# Altium schematic sheet lv_io_solenoid_drv.SchDoc
size A4; Organization: Badgerloop; Address1: 133 Engineering Research; Address2: Building; Address3: Madison, WI 53715
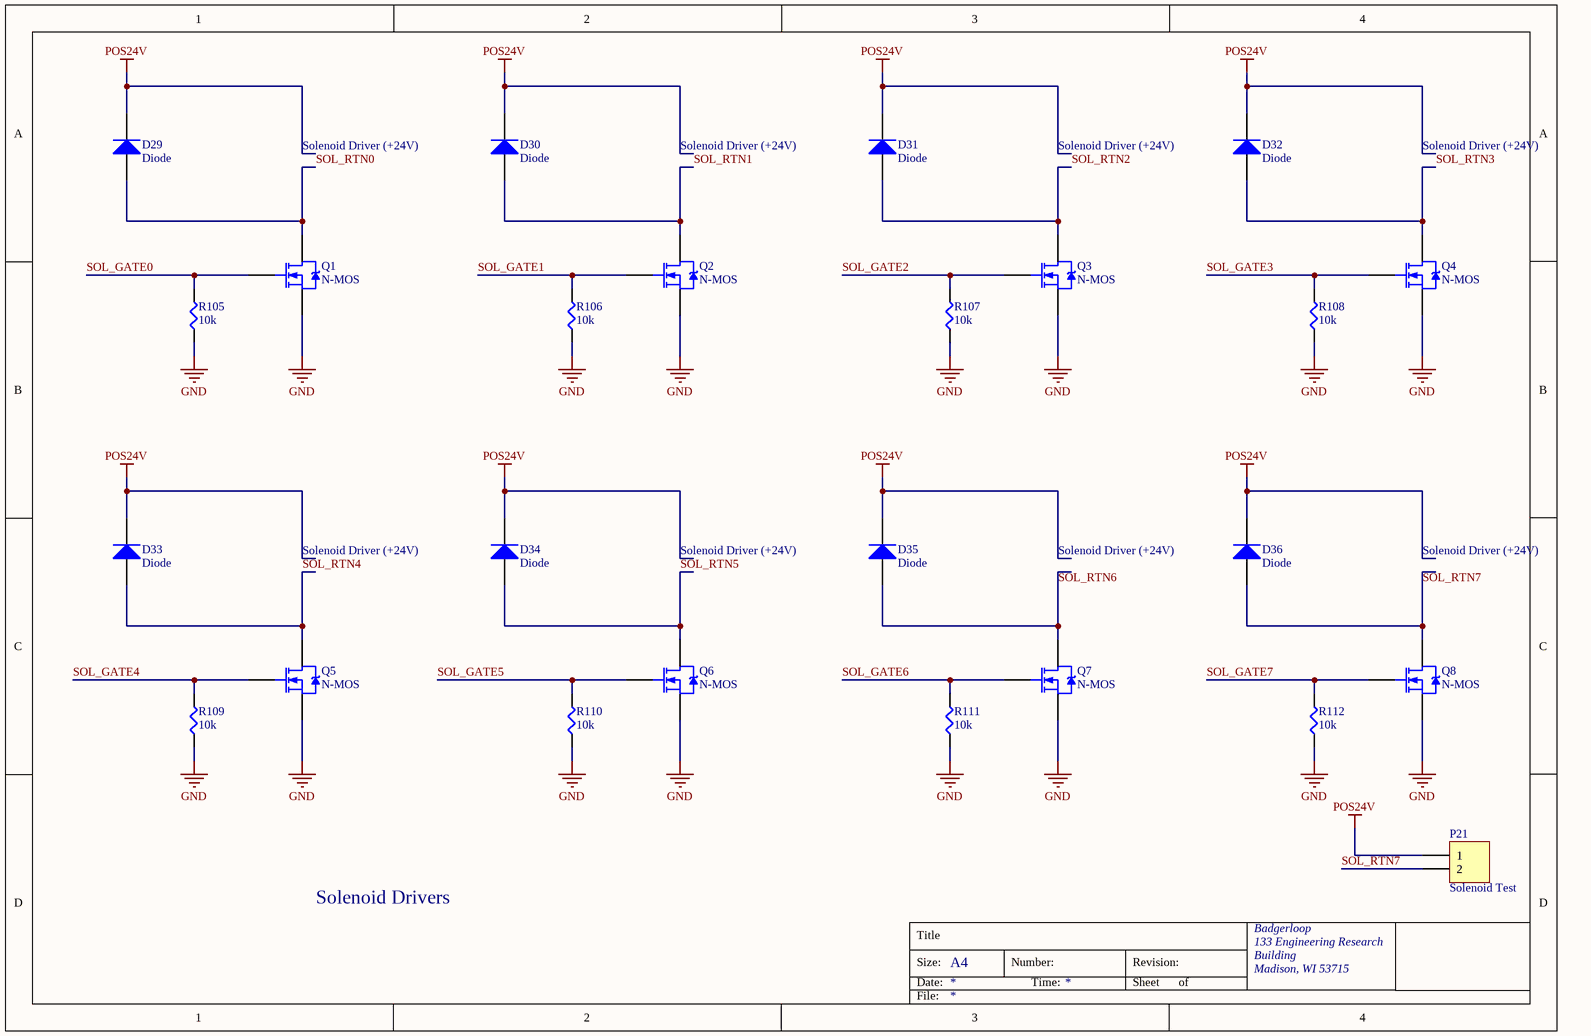
[diagram p0: lv_io_solenoid_drv.SchDoc]

## Parts
D29  Diode  [SODFL360X110-2N]
D30  Diode  [SODFL360X110-2N]
D31  Diode  [SODFL360X110-2N]
D32  Diode  [SODFL360X110-2N]
D33  Diode  [SODFL360X110-2N]
D34  Diode  [SODFL360X110-2N]
D35  Diode  [SODFL360X110-2N]
D36  Diode  [SODFL360X110-2N]
P21  Solenoid Test  [Pin Header 1x2 TH Pitch 2.54mm]
Q1  N-MOS  [DPAK228P991X238-3N]
Q2  N-MOS  [DPAK228P991X238-3N]
Q3  N-MOS  [DPAK228P991X238-3N]
Q4  N-MOS  [DPAK228P991X238-3N]
Q5  N-MOS  [DPAK228P991X238-3N]
Q6  N-MOS  [DPAK228P991X238-3N]
Q7  N-MOS  [DPAK228P991X238-3N]
Q8  N-MOS  [DPAK228P991X238-3N]
R105  10k  [SMD-0402-RES]
R106  10k  [SMD-0402-RES]
R107  10k  [SMD-0402-RES]
R108  10k  [SMD-0402-RES]
R109  10k  [SMD-0402-RES]
R110  10k  [SMD-0402-RES]
R111  10k  [SMD-0402-RES]
R112  10k  [SMD-0402-RES]

## Nets
GND: Q1.3(S) Q2.3(S) Q3.3(S) Q4.3(S) Q5.3(S) Q6.3(S) Q7.3(S) Q8.3(S) R105.1 R106.1 R107.1 R108.1 R109.1 R110.1 R111.1 R112.1
POS24V: D29.2(K) D30.2(K) D31.2(K) D32.2(K) D33.2(K) D34.2(K) D35.2(K) D36.2(K) P21.1
SOL_GATE0: Q1.1(G) R105.2
SOL_GATE1: Q2.1(G) R106.2
SOL_GATE2: Q3.1(G) R107.2
SOL_GATE3: Q4.1(G) R108.2
SOL_GATE4: Q5.1(G) R109.2
SOL_GATE5: Q6.1(G) R110.2
SOL_GATE6: Q7.1(G) R111.2
SOL_GATE7: Q8.1(G) R112.2
SOL_RTN0: D29.1(A) Q1.4(D)
SOL_RTN1: D30.1(A) Q2.4(D)
SOL_RTN2: D31.1(A) Q3.4(D)
SOL_RTN3: D32.1(A) Q4.4(D)
SOL_RTN4: D33.1(A) Q5.4(D)
SOL_RTN5: D34.1(A) Q6.4(D)
SOL_RTN6: D35.1(A) Q7.4(D)
SOL_RTN7: D36.1(A) P21.2 Q8.4(D)

## Notes on the sheet
- Solenoid Driver (+24V)
- Solenoid Drivers
- Title
- Size:
- Date:
- A4
- Number:
- Time:
- Revision:
- Sheet
- of
- File:

## Library data of the parts
D29-D36 = DIODE STD: DIODE GEN PURP 200V 2A SOD123FL; Manufacturer: ON SEMI; Manufacturer P/N: NHP220SFT3G; Digikey Link: https://www.digikey.com/product-detail/en/on-semiconductor/NHP220SFT3G/NHP220SFT3GOSCT-ND/5801747; Digikey P/N: NHP220SFT3GOSCT-ND
P21 = Header 2: Header, 2-Pin; LatestRevisionDate: 17-Jul-2002; LatestRevisionNote: Re-released for DXP Platform.; Publisher: Altium Limited
Q1-Q8 = N-MOS: N-Channel Power MOSFET, 12 A, 60 V; Manufacturer: ON SEMI; Manufacturer P/N: NTD3055L104T4G; Digikey Link: https://www.digikey.com/product-detail/en/on-semiconductor/NTD3055L104T4G/NTD3055L104T4GOSDKR-ND/1749196; Digikey P/N: NTD3055L104T4GOSDKR-ND
R105-R112 = ERJ-2RHD1002X: RES SMD 10K OHM 0.5% 1/16W 0402; Manufacturer: Panasonic Electronic Components; Factory Stock: 0; Unit Price (USD): 0.01767; @ qty: 1500; Minimum Quantity: 1; Power (Watts): 0.063W, 1/16W; Temperature Coefficient: ±50ppm/°C; Part Number: ERJ-2RHD1002X; Datasheets: http://industrial.panasonic.com/www-cgi/jvcr13pz.cgi?E+PZ+3+AOA0001+ERJ2RHD1002X+8+WW; Image: //media.digikey.com/Photos/Panasonic%20Photos/ERJ-PA2-Series.jpg; Digi-Key Part Number: P15984CT-ND; Quantity Available: 67996; Packaging: Cut Tape (CT); Series: ERJ; Part Status: Active; Value: 10k; Tolerance: ±0.5%; Composition: Thick Film; Features: Automotive AEC-Q200; Operating Temperature: -55°C ~ 125°C; Package / Case: 0402 (1005 Metric); Supplier Device Package: 0402; Size / Dimension: 0.039" L x 0.020" W (1.00mm x 0.50mm); Height - Seated (Max): 0.016" (0.40mm); Number of Terminations: 2; Failure Rate: -